# EAGLE design OMAPProc_Rev2 (EAGLE 6.2)
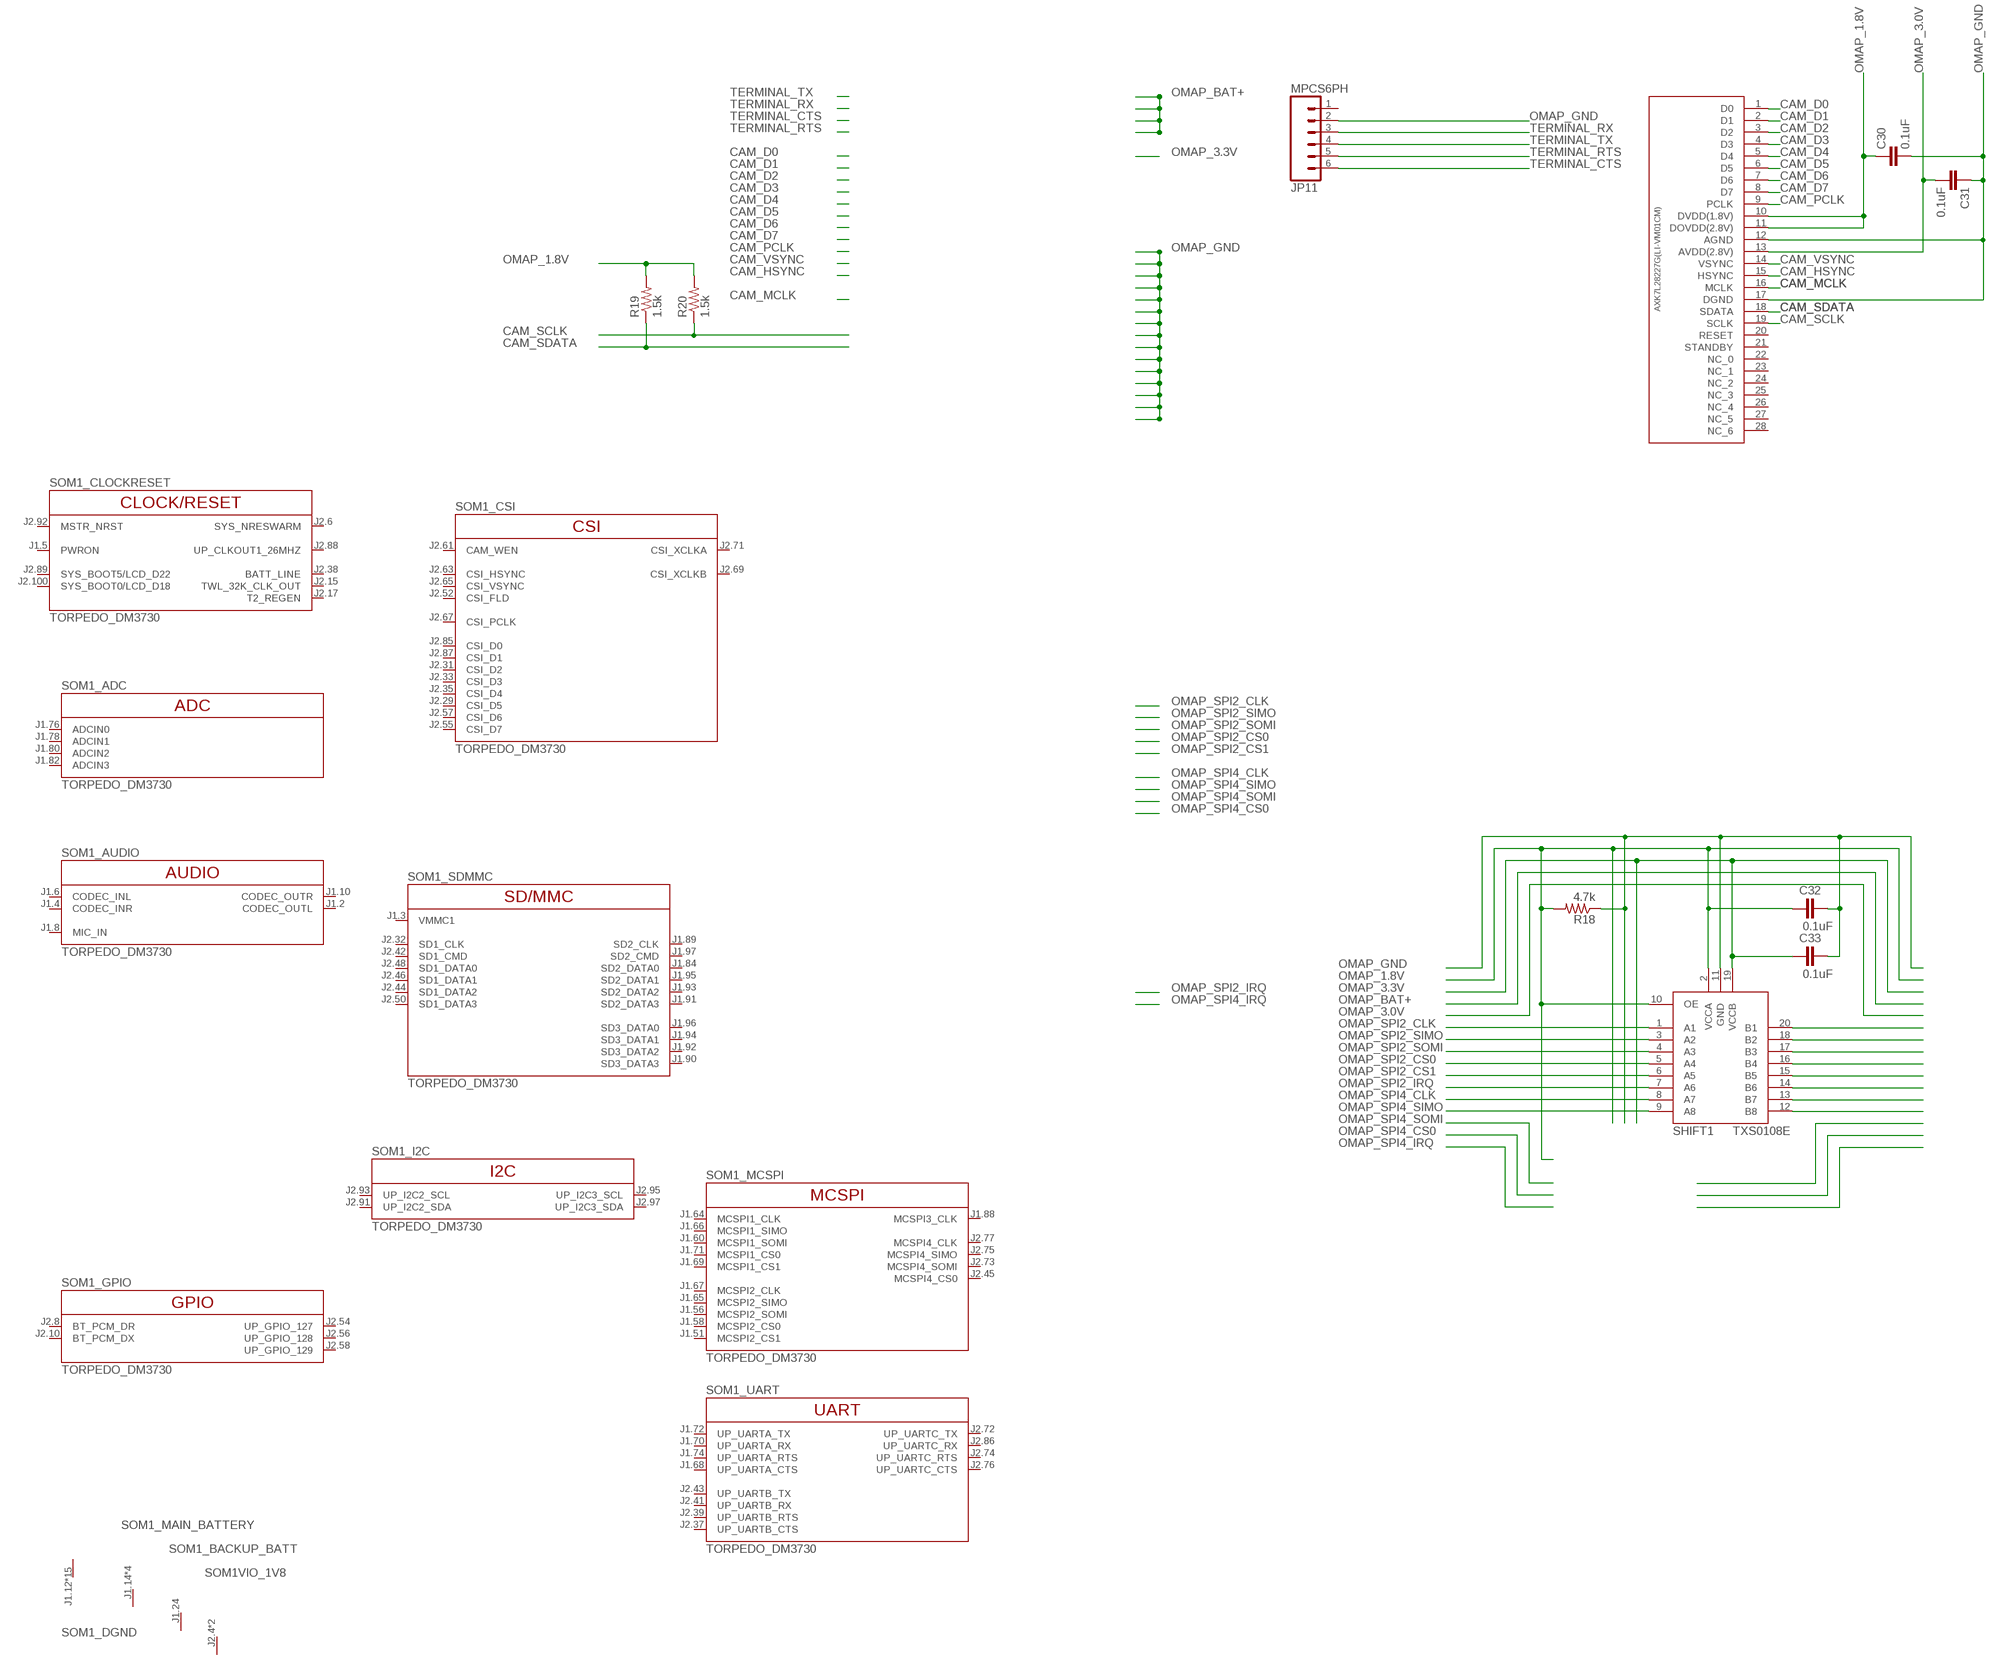
[diagram p0: schematic, sheet 1]

## Parts
C30  0.1uF  CAP0402-CAP  [0402-CAP]
C31  0.1uF  CAP0402-CAP  [0402-CAP]
C32  0.1uF  CAP0402-CAP  [0402-CAP]
C33  0.1uF  CAP0402-CAP  [0402-CAP]
CAM1  AXK7L28227G(LI-VM01CM)  [AXK7L28227G]
JP11  MPCS6PH  [MOLEX-PICO_CLASP_S6P]
R18  4.7k  R-US_R0402  [R0402]
R19  1.5k  R-US_R0402  [R0402]
R20  1.5k  R-US_R0402  [R0402]
SHIFT1  TXS0108E  [PW_R-PDSO-G20]
SOM1  TORPEDO_DM3730  [TORPEDO_DM3730]

## Nets
CAM_D0: CAM1.1(D0)
CAM_D1: CAM1.2(D1)
CAM_D2: CAM1.3(D2)
CAM_D3: CAM1.4(D3)
CAM_D4: CAM1.5(D4)
CAM_D5: CAM1.6(D5)
CAM_D6: CAM1.7(D6)
CAM_D7: CAM1.8(D7)
CAM_HSYNC: CAM1.15(HSYNC)
CAM_MCLK: CAM1.16(MCLK)
CAM_PCLK: CAM1.9(PCLK)
CAM_SCLK: CAM1.19(SCLK) R20.1
CAM_SDATA: CAM1.18(SDATA) R19.1
CAM_VSYNC: CAM1.14(VSYNC)
N$18: SHIFT1.20(B1)
N$22: SHIFT1.18(B2)
N$27: SHIFT1.17(B3)
N$30: SHIFT1.16(B4)
N$31: SHIFT1.15(B5)
N$33: SHIFT1.14(B6)
N$34: SHIFT1.13(B7)
N$35: SHIFT1.12(B8)
OMAP_1.8V: C30.1 C32.1 CAM1.10(DVDD(1.8V)) CAM1.11(DOVDD(2.8V)) R18.2 R19.2 R20.2 SHIFT1.2(VCCA) SHIFT1.10(OE)
OMAP_3.0V: C31.2 CAM1.13(AVDD(2.8V))
OMAP_3.3V: C33.1 SHIFT1.19(VCCB)
OMAP_GND [sup]: C30.2 C31.1 C32.2 C33.2 CAM1.12(AGND) CAM1.17(DGND) JP11.2 R18.1 SHIFT1.11(GND)
OMAP_SPI2_CLK: SHIFT1.1(A1)
OMAP_SPI2_CS0: SHIFT1.5(A4)
OMAP_SPI2_CS1: SHIFT1.6(A5)
OMAP_SPI2_IRQ: SHIFT1.7(A6)
OMAP_SPI2_SIMO: SHIFT1.3(A2)
OMAP_SPI2_SOMI: SHIFT1.4(A3)
OMAP_SPI4_CLK: SHIFT1.8(A7)
OMAP_SPI4_SIMO: SHIFT1.9(A8)
TERMINAL_CTS: JP11.6
TERMINAL_RTS: JP11.5
TERMINAL_RX: JP11.3
TERMINAL_TX: JP11.4
Unconnected: CAM1.20(RESET) CAM1.21(STANDBY) CAM1.22(NC_0) CAM1.23(NC_1) CAM1.24(NC_2) CAM1.25(NC_3) CAM1.26(NC_4) CAM1.27(NC_5) CAM1.28(NC_6) JP11.1 SOM1.J1.1(_GPMC:UP_NWE) SOM1.J1.2(_AUDIO:CODEC_OUTL) SOM1.J1.3(_SDMMC:VMMC1) SOM1.J1.4(_AUDIO:CODEC_INR) SOM1.J1.5(_CLOCKRESET:PWRON) SOM1.J1.6(_AUDIO:CODEC_INL) SOM1.J1.7(_GPMC:UP_A9) SOM1.J1.8(_AUDIO:MIC_IN) SOM1.J1.9(_GPMC:UP_NCS0) SOM1.J1.10(_AUDIO:CODEC_OUTR) SOM1.J1.11(_GPMC:UP_NCS1) SOM1.J1.13(_GPMC:UP_A8) SOM1.J1.15(_GPMC:UP_NOE) SOM1.J1.19(_GPMC:UP_BUS_CLK) SOM1.J1.21(_GPMC:UP_NBE1) SOM1.J1.23(_GPMC:UP_NADV_ALE) SOM1.J1.25(_GPMC:UP_NBE0) SOM1.J1.26(_GPMC:UP_NWAIT) SOM1.J1.28(_GPMC:UP_NCS6) SOM1.J1.29(_GPMC:UP_D8) SOM1.J1.30(_GPMC:UP_DREQ0) SOM1.J1.31(_GPMC:UP_D9) SOM1.J1.32(_GPMC:UP_NCS5) SOM1.J1.33(_GPMC:UP_D2) SOM1.J1.34(_GPMC:UP_NCS4) SOM1.J1.35(_GPMC:UP_D0) SOM1.J1.36(_GPMC:UP_NCS3) SOM1.J1.37(_GPMC:UP_D1) SOM1.J1.38(_GPMC:UP_A10) SOM1.J1.39(_GPMC:UP_D3) SOM1.J1.40(_GPMC:UP_NCS2) SOM1.J1.41(_GPMC:UP_D12) SOM1.J1.42(_GPMC:UP_A4) SOM1.J1.43(_GPMC:UP_D10) SOM1.J1.44(_GPMC:UP_A3) SOM1.J1.45(_GPMC:UP_D11) SOM1.J1.46(_GPMC:UP_A2) SOM1.J1.47(_GPMC:UP_D13) SOM1.J1.48(_GPMC:UP_A1) SOM1.J1.49(_GPMC:UP_D4) SOM1.J1.50(_GPMC:UP_A7) SOM1.J1.51(_MCSPI:MCSPI2_CS1) SOM1.J1.52(_GPMC:UP_A6) SOM1.J1.53(_GPMC:UP_D6) SOM1.J1.54(_GPMC:UP_A5) SOM1.J1.55(_GPMC:UP_D7) SOM1.J1.56(_MCSPI:MCSPI2_SOMI) SOM1.J1.57(_GPMC:UP_D5) SOM1.J1.58(_MCSPI:MCSPI2_CS0) SOM1.J1.59(_GPMC:UP_D14) SOM1.J1.60(_MCSPI:MCSPI1_SOMI) SOM1.J1.62(_MCBSP:MCBSP4_DR) SOM1.J1.63(_GPMC:UP_D15) SOM1.J1.64(_MCSPI:MCSPI1_CLK) SOM1.J1.65(_MCSPI:MCSPI2_SIMO) SOM1.J1.66(_MCSPI:MCSPI1_SIMO) SOM1.J1.67(_MCSPI:MCSPI2_CLK) SOM1.J1.68(_UART:UP_UARTA_CTS) SOM1.J1.69(_MCSPI:MCSPI1_CS1) SOM1.J1.70(_UART:UP_UARTA_RX) SOM1.J1.71(_MCSPI:MCSPI1_CS0) SOM1.J1.72(_UART:UP_UARTA_TX) SOM1.J1.73(_LCDTV:LCD_PANEL_PWR) SOM1.J1.74(_UART:UP_UARTA_RTS) SOM1.J1.75(_LCDTV:LCD_BACKLIGHT_PWR) SOM1.J1.76(_ADC:ADCIN0) SOM1.J1.77(_MCBSP:MCBSP3_DR) SOM1.J1.78(_ADC:ADCIN1) SOM1.J1.79(_MCBSP:MCBSP3_DX) SOM1.J1.80(_ADC:ADCIN2) SOM1.J1.81(_MCBSP:MCBSP3_FSX) SOM1.J1.82(_ADC:ADCIN3) SOM1.J1.83(_MCBSP:MCBSP3_CLKX) SOM1.J1.84(_SDMMC:SD2_DATA0) SOM1.J1.86(_LCDTV:LCD_D17) SOM1.J1.87(_LCDTV:LCD_D23/SYS_BOOT6) SOM1.J1.88(_MCSPI:MCSPI3_CLK) SOM1.J1.89(_SDMMC:SD2_CLK) SOM1.J1.90(_SDMMC:SD3_DATA3) SOM1.J1.91(_SDMMC:SD2_DATA3) SOM1.J1.92(_SDMMC:SD3_DATA2) SOM1.J1.93(_SDMMC:SD2_DATA2) SOM1.J1.94(_SDMMC:SD3_DATA1) SOM1.J1.95(_SDMMC:SD2_DATA1) SOM1.J1.96(_SDMMC:SD3_DATA0) SOM1.J1.97(_SDMMC:SD2_CMD) SOM1.J1.98(_GPMC:UP_IODIR) SOM1.J1.99(_LCDTV:LCD_D16) SOM1.J2.3(_USB:USB1_D+) SOM1.J2.5(_USB:USB1_D-) SOM1.J2.6(_CLOCKRESET:SYS_NRESWARM) SOM1.J2.8(_GPIO:BT_PCM_DR) SOM1.J2.9(_USB:USB1_ID) SOM1.J2.10(_GPIO:BT_PCM_DX) SOM1.J2.11(_USB:USB1_VBUS) SOM1.J2.12(_LCDTV:LCD_HSYNC) SOM1.J2.13(_USB:USB1_VBUS) SOM1.J2.14(_LCDTV:LCD_VSYNC) SOM1.J2.15(_CLOCKRESET:TWL_32K_CLK_OUT) SOM1.J2.16(_LCDTV:LCD_MDISP) SOM1.J2.17(_CLOCKRESET:T2_REGEN) SOM1.J2.18(_LCDTV:LCD_D6/G1) SOM1.J2.20(_LCDTV:LCD_D20/SYS_BOOT3) SOM1.J2.22(_LCDTV:LCD_D9/G4) SOM1.J2.24(_LCDTV:LCD_D8/G3) SOM1.J2.26(_LCDTV:LCD_D7/G2) SOM1.J2.28(_LCDTV:LCD_DCLK) SOM1.J2.29(_CSI:CSI_D5) SOM1.J2.31(_CSI:CSI_D2) SOM1.J2.32(_SDMMC:SD1_CLK) SOM1.J2.33(_CSI:CSI_D3) SOM1.J2.34(_LCDTV:LCD_D19/SYS_BOOT1) SOM1.J2.35(_CSI:CSI_D4) SOM1.J2.36(_LCDTV:LCD_D18/SYS_BOOT0) SOM1.J2.37(_UART:UP_UARTB_CTS) SOM1.J2.38(_CLOCKRESET:BATT_LINE) SOM1.J2.39(_UART:UP_UARTB_RTS) SOM1.J2.40(_LCDTV:LCD_D21/SYS_BOOT4) SOM1.J2.41(_UART:UP_UARTB_RX) SOM1.J2.42(_SDMMC:SD1_CMD) SOM1.J2.43(_UART:UP_UARTB_TX) SOM1.J2.44(_SDMMC:SD1_DATA2) SOM1.J2.45(_MCSPI:MCSPI4_CS0) SOM1.J2.46(_SDMMC:SD1_DATA1) SOM1.J2.47(_MCBSP:MCBSP2_DX) SOM1.J2.48(_SDMMC:SD1_DATA0) SOM1.J2.49(_MCBSP:MCBSP2_CLKX) SOM1.J2.50(_SDMMC:SD1_DATA3) SOM1.J2.51(_MCBSP:MCBSP2_FSX) SOM1.J2.52(_CSI:CSI_FLD) SOM1.J2.53(_MCBSP:MCBSP2_DR) SOM1.J2.54(_GPIO:UP_GPIO_127) SOM1.J2.55(_CSI:CSI_D7) SOM1.J2.56(_GPIO:UP_GPIO_128) SOM1.J2.57(_CSI:CSI_D6) SOM1.J2.58(_GPIO:UP_GPIO_129) SOM1.J2.60(_LCDTV:TV_OUT2) SOM1.J2.61(_CSI:CAM_WEN) SOM1.J2.63(_CSI:CSI_HSYNC) SOM1.J2.64(_LCDTV:TV_OUT1) SOM1.J2.65(_CSI:CSI_VSYNC) SOM1.J2.66(_LCDTV:LCD_D14/R4) SOM1.J2.67(_CSI:CSI_PCLK) SOM1.J2.68(_LCDTV:LCD_D13/R3) SOM1.J2.69(_CSI:CSI_XCLKB) SOM1.J2.70(_LCDTV:LCD_D12/R2) SOM1.J2.71(_CSI:CSI_XCLKA) SOM1.J2.72(_UART:UP_UARTC_TX) SOM1.J2.73(_MCSPI:MCSPI4_SOMI) SOM1.J2.74(_UART:UP_UARTC_RTS) SOM1.J2.75(_MCSPI:MCSPI4_SIMO) SOM1.J2.76(_UART:UP_UARTC_CTS) SOM1.J2.77(_MCSPI:MCSPI4_CLK) SOM1.J2.78(_LCDTV:LCD_D15/R5) SOM1.J2.79(_LCDTV:LCD_D2/B3) SOM1.J2.80(_LCDTV:LCD_D22/SYS_BOOT5) SOM1.J2.81(_LCDTV:LCD_D3/B4) SOM1.J2.82(_LCDTV:LCD_D10/G5) SOM1.J2.83(_LCDTV:LCD_D1/B2) SOM1.J2.84(_LCDTV:LCD_D11/R1) SOM1.J2.85(_CSI:CSI_D0) SOM1.J2.86(_UART:UP_UARTC_RX) SOM1.J2.87(_CSI:CSI_D1) SOM1.J2.88(_CLOCKRESET:UP_CLKOUT1_26MHZ) SOM1.J2.89(_CLOCKRESET:SYS_BOOT5/LCD_D22) SOM1.J2.91(_I2C:UP_I2C2_SDA) SOM1.J2.92(_CLOCKRESET:MSTR_NRST) SOM1.J2.93(_I2C:UP_I2C2_SCL) SOM1.J2.94(_LCDTV:LCD_D4/B5) SOM1.J2.95(_I2C:UP_I2C3_SCL) SOM1.J2.96(_LCDTV:LCD_D5/G0) SOM1.J2.97(_I2C:UP_I2C3_SDA) SOM1.J2.98(_LCDTV:LCD_D0/B1) SOM1.J2.100(_CLOCKRESET:SYS_BOOT0/LCD_D18)

## Power pins joined to a net without a drawn wire
V+: SOM1.J1.14(_MAIN_BATTERY:V+) SOM1.J1.16(_MAIN_BATTERY:V+) SOM1.J1.18(_MAIN_BATTERY:V+) SOM1.J1.20(_MAIN_BATTERY:V+) SOM1.J1.24(_BACKUP_BATT:V+) SOM1.J2.4(VIO_1V8:V+) SOM1.J2.7(VIO_1V8:V+)
V-: SOM1.J1.12(_DGND:V-) SOM1.J1.17(_DGND:V-) SOM1.J1.22(_DGND:V-) SOM1.J1.27(_DGND:V-) SOM1.J1.61(_DGND:V-) SOM1.J1.85(_DGND:V-) SOM1.J1.100(_DGND:V-) SOM1.J2.1(_DGND:V-) SOM1.J2.2(_DGND:V-) SOM1.J2.27(_DGND:V-) SOM1.J2.30(_DGND:V-) SOM1.J2.59(_DGND:V-) SOM1.J2.62(_DGND:V-) SOM1.J2.90(_DGND:V-) SOM1.J2.99(_DGND:V-)

## Library data of the parts
C30-C33 = SparkFun:CAP: Capacitor Standard 0603 ceramic capacitor, and 0.1" leaded capacitor.
CAM1 = user:AXK7L28227G(LI-VM01CM)
JP11 = stan:MPCS6P: Molex Pico-Clasp Single Row 6 Pos
R18-R20 = rcl:R-US_: RESISTOR, American symbol
SHIFT1 = user:TXS0108E
SOM1 = biomimetic:TORPEDO_DM3730

## Net classes
1 sup: width 0.254 mm

## Board
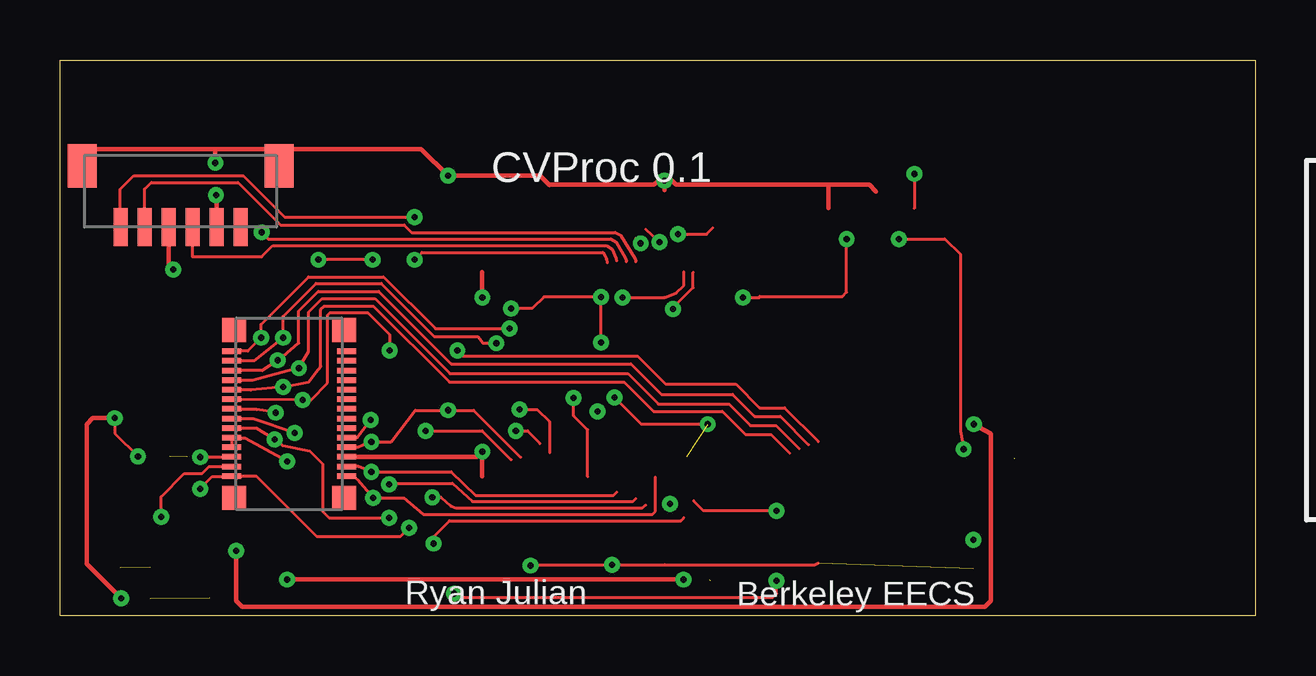
[diagram p1: board, top side]
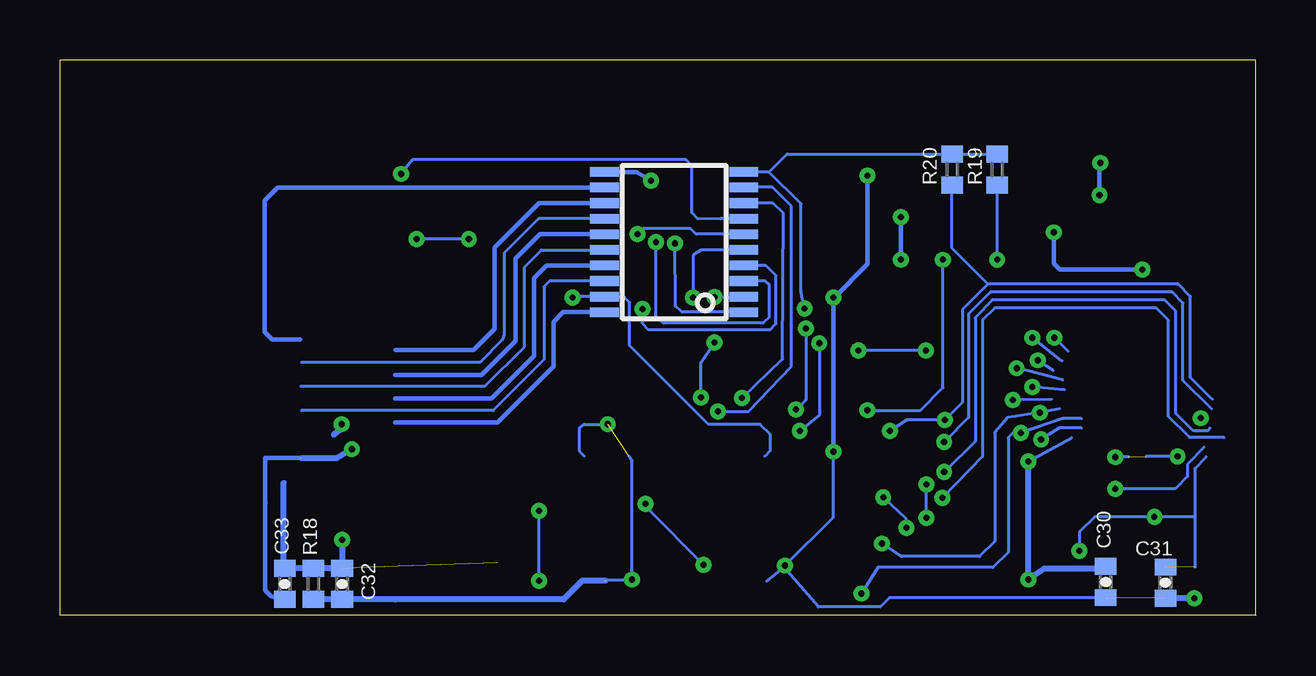
[diagram p2: board, bottom side, seen from below]

Size 49.83 x 23.17 mm. Coordinates in mm from the lower left corner, seen from the top.
Outline: 0,0.01 0,0
Outline: 0,0.01 0,23.18 49.84,23.18 49.84,0.01 0,0.01
Copper layers (1*16): Top 0.0356mm / dielectric 1.5011mm / Bottom 0.0356mm
Design rules: minimum track width 5mil, minimum drill 6mil, track to track 5mil, track to pad 5mil, pad to pad 5mil, via to via 5mil, smd to smd 5mil, copper to edge 15mil, drill to drill 8mil, minimum pad ring 10mil, minimum via ring 8mil, stop-mask expansion 4mil, vias tented up to drill 0mil, thermal gap 10mil

### Footprints (pad centres in the part's own frame; a part is rotated, then mirrored left to right if it is on the bottom)
0402-CAP = smd 0.7 x 0.9: 1 -0.65,0; 2 0.65,0
AXK7L28227G = smd 0.23 x 0.8: 1 0.6,2.4; 2 0.2,2.4; 3 -0.2,2.4; 4 -0.6,2.4; 5 -1,2.4; 6 -1.4,2.4; 7 -1.8,2.4; 8 -2.2,2.4; 9 -2.6,2.4; 10 -3,2.4; 11 -3.4,2.4; 12 -3.8,2.4; 13 -4.2,2.4; 14 -4.6,2.4; 15 -4.6,-2.4; 16 -4.2,-2.4; 17 -3.8,-2.4; 18 -3.4,-2.4; 19 -3,-2.4; 20 -2.6,-2.4; 21 -2.2,-2.4; 22 -1.8,-2.4; 23 -1.4,-2.4; 24 -1,-2.4; 25 -0.6,-2.4; 26 -0.2,-2.4; 27 0.2,-2.4; 28 0.6,-2.4 | smd 1 x 1: M1 1.5,2.3; M14 -5.5,2.3; M15 -5.5,-2.3; M28 1.5,-2.3
MOLEX-PICO_CLASP_S6P = smd 0.6 x 1.6: 1 -2.5,1; 2 -1.5,1; 3 -0.5,1; 4 0.5,1; 5 1.5,1; 6 2.5,1 | smd 1.2 x 1.8: A -4.1,-1.55; B 4.1,-1.55
R0402 = smd 0.7 x 0.9: 1 -0.65,0; 2 0.65,0
PW_R-PDSO-G20 = smd 0.4 x 1.2: 1 -2.925,-2.9; 2 -2.275,-2.9; 3 -1.625,-2.9; 4 -0.975,-2.9; 5 -0.325,-2.9; 6 0.325,-2.9; 7 0.975,-2.9; 8 1.625,-2.9; 9 2.275,-2.9; 10 2.925,-2.9; 11 2.925,2.9; 12 2.275,2.9; 13 1.625,2.9; 14 0.975,2.9; 15 0.325,2.9; 16 -0.325,2.9; 17 -0.975,2.9; 18 -1.625,2.9; 19 -2.275,2.9; 20 -2.925,2.9
TORPEDO_DM3730 = smd 0.2 x 1.44: J1.1 -9.8,-7.06; J1.2 -9.8,-4.12; J1.3 -9.4,-7.06; J1.4 -9.4,-4.12; J1.5 -9,-7.06; J1.6 -9,-4.12; J1.7 -8.6,-7.06; J1.8 -8.6,-4.12; J1.9 -8.2,-7.06; J1.10 -8.2,-4.12; J1.11 -7.8,-7.06; J1.12 -7.8,-4.12; J1.13 -7.4,-7.06; J1.14 -7.4,-4.12; J1.15 -7,-7.06; J1.16 -7,-4.12; J1.17 -6.6,-7.06; J1.18 -6.6,-4.12; J1.19 -6.2,-7.06; J1.20 -6.2,-4.12; J1.21 -5.8,-7.06; J1.22 -5.8,-4.12; J1.23 -5.4,-7.06; J1.24 -5.4,-4.12; J1.25 -5,-7.06; J1.26 -5,-4.12; J1.27 -4.6,-7.06; J1.28 -4.6,-4.12; J1.29 -4.2,-7.06; J1.30 -4.2,-4.12; J1.31 -3.8,-7.06; J1.32 -3.8,-4.12; J1.33 -3.4,-7.06; J1.34 -3.4,-4.12; J1.35 -3,-7.06; J1.36 -3,-4.12; J1.37 -2.6,-7.06; J1.38 -2.6,-4.12; J1.39 -2.2,-7.06; J1.40 -2.2,-4.12; J1.41 -1.8,-7.06; J1.42 -1.8,-4.12; J1.43 -1.4,-7.06; J1.44 -1.4,-4.12; J1.45 -1,-7.06; J1.46 -1,-4.12; J1.47 -0.6,-7.06; J1.48 -0.6,-4.12; J1.49 -0.2,-7.06; J1.50 -0.2,-4.12; J1.51 0.2,-7.06; J1.52 0.2,-4.12; J1.53 0.6,-7.06; J1.54 0.6,-4.12; J1.55 1,-7.06; J1.56 1,-4.12; J1.57 1.4,-7.06; J1.58 1.4,-4.12; J1.59 1.8,-7.06; J1.60 1.8,-4.12; J1.61 2.2,-7.06; J1.62 2.2,-4.12; J1.63 2.6,-7.06; J1.64 2.6,-4.12; J1.65 3,-7.06; J1.66 3,-4.12; J1.67 3.4,-7.06; J1.68 3.4,-4.12; J1.69 3.8,-7.06; J1.70 3.8,-4.12; J1.71 4.2,-7.06; J1.72 4.2,-4.12; J1.73 4.6,-7.06; J1.74 4.6,-4.12; J1.75 5,-7.06; J1.76 5,-4.12; J1.77 5.4,-7.06; J1.78 5.4,-4.12; J1.79 5.8,-7.06; J1.80 5.8,-4.12; J1.81 6.2,-7.06; J1.82 6.2,-4.12; J1.83 6.6,-7.06; J1.84 6.6,-4.12; J1.85 7,-7.06; J1.86 7,-4.12; J1.87 7.4,-7.06; J1.88 7.4,-4.12; J1.89 7.8,-7.06; J1.90 7.8,-4.12; J1.91 8.2,-7.06; J1.92 8.2,-4.12; J1.93 8.6,-7.06; J1.94 8.6,-4.12; J1.95 9,-7.06; J1.96 9,-4.12; J1.97 9.4,-7.06; J1.98 9.4,-4.12; J1.99 9.8,-7.06; J1.100 9.8,-4.12; J2.1 -9.8,4.12; J2.2 -9.8,7.06; J2.3 -9.4,4.12; J2.4 -9.4,7.06; J2.5 -9,4.12; J2.6 -9,7.06; J2.7 -8.6,4.12; J2.8 -8.6,7.06; J2.9 -8.2,4.12; J2.10 -8.2,7.06; J2.11 -7.8,4.12; J2.12 -7.8,7.06; J2.13 -7.4,4.12; J2.14 -7.4,7.06; J2.15 -7,4.12; J2.16 -7,7.06; J2.17 -6.6,4.12; J2.18 -6.6,7.06; J2.19 -6.2,4.12; J2.20 -6.2,7.06; J2.21 -5.8,4.12; J2.22 -5.8,7.06; J2.23 -5.4,4.12; J2.24 -5.4,7.06; J2.25 -5,4.12; J2.26 -5,7.06; J2.27 -4.6,4.12; J2.28 -4.6,7.06; J2.29 -4.2,4.12; J2.30 -4.2,7.06; J2.31 -3.8,4.12; J2.32 -3.8,7.06; J2.33 -3.4,4.12; J2.34 -3.4,7.06; J2.35 -3,4.12; J2.36 -3,7.06; J2.37 -2.6,4.12; J2.38 -2.6,7.06; J2.39 -2.2,4.12; J2.40 -2.2,7.06; J2.41 -1.8,4.12; J2.42 -1.8,7.06; J2.43 -1.4,4.12; J2.44 -1.4,7.06; J2.45 -1,4.12; J2.46 -1,7.06; J2.47 -0.6,4.12; J2.48 -0.6,7.06; J2.49 -0.2,4.12; J2.50 -0.2,7.06; J2.51 0.2,4.12; J2.52 0.2,7.06; J2.53 0.6,4.12; J2.54 0.6,7.06; J2.55 1,4.12; J2.56 1,7.06; J2.57 1.4,4.12; J2.58 1.4,7.06; J2.59 1.8,4.12; J2.60 1.8,7.06; J2.61 2.2,4.12; J2.62 2.2,7.06; J2.63 2.6,4.12; J2.64 2.6,7.06; J2.65 3,4.12; J2.66 3,7.06; J2.67 3.4,4.12; J2.68 3.4,7.06; J2.69 3.8,4.12; J2.70 3.8,7.06; J2.71 4.2,4.12; J2.72 4.2,7.06; J2.73 4.6,4.12; J2.74 4.6,7.06; J2.75 5,4.12; J2.76 5,7.06; J2.77 5.4,4.12; J2.78 5.4,7.06; J2.79 5.8,4.12; J2.80 5.8,7.06; J2.81 6.2,4.12; J2.82 6.2,7.06; J2.83 6.6,4.12; J2.84 6.6,7.06; J2.85 7,4.12; J2.86 7,7.06; J2.87 7.4,4.12; J2.88 7.4,7.06; J2.89 7.8,4.12; J2.90 7.8,7.06; J2.91 8.2,4.12; J2.92 8.2,7.06; J2.93 8.6,4.12; J2.94 8.6,7.06; J2.95 9,4.12; J2.96 9,7.06; J2.97 9.4,4.12; J2.98 9.4,7.06; J2.99 9.8,4.12; J2.100 9.8,7.06

### Placement (x,y rotation side)
C30  6.25,1.41 270 bottom
C31  3.76,1.38 90 bottom
C32  38.07,1.33 90 bottom
C33  40.46,1.33 90 bottom
CAM1  9.55,10.42 90 top
JP11  5.03,17.21 180 top
R18  39.27,1.33 270 bottom
R19  10.77,18.6 90 bottom
R20  12.65,18.6 90 bottom
SHIFT1  24.23,15.58 90 bottom
SOM1  65.66,11.49 180 top  (outside the outline)

### Tracks (layer width: path | path; a pad name or v marks a point on that pad's centre or on a via)
CAM_D0  (via drill 0.25 pad 0.66)
  Top 0.127: v8.38,11.59 7.82,11.03 7.26,11.03 CAM1.1 | v8.38,11.59 8.38,11.64 | v18.75,11.97 15.65,11.97 13.49,14.13 10.36,14.13 8.38,12.15 v8.38,11.59 | v19.15,8.6 19.89,8.6 20.4,8.1 20.41,6.81
  Bottom 0.127: 7.81,11.02 v8.38,11.59 | v18.75,11.97 18.75,9 v19.15,8.6
CAM_D1  (via drill 0.25 pad 0.66)
  Top 0.127: CAM1.2 7.25,10.63 8.08,10.63 v9.3,11.59 9.3,12.48 10.67,13.85 13.39,13.85 15.6,11.64 17.42,11.64 17.63,11.36 v18.19,11.36 | v19,7.71 19.5,7.71 20.01,7.19 20.01,7.18
  Bottom 0.127: 8.07,10.62 v9.3,11.59 | v18.19,11.36 18.19,8.37 v19,7.71
CAM_D2  (via drill 0.25 pad 0.66)
  Top 0.127: 7.25,10.22 CAM1.3 8.43,10.22 v9.07,10.65 9.14,10.65 9.3,10.8 9.96,11.36 9.96,12.71 10.77,13.52 13.28,13.52 16.31,10.5 23.8,10.5 25.07,9.23 28.04,9.23 28.96,8.32 30.02,8.32 31.21,7.13
  Bottom 0.127: 8.44,10.22 v9.07,10.65
CAM_D3  (via drill 0.25 pad 0.66)
  Top 0.127: CAM1.4 7.26,9.81 8.03,9.81 v9.96,10.32 10.36,11.01 10.36,12.66 10.92,13.22 13.13,13.22 16.26,10.09 23.67,10.09 24.94,8.82 27.89,8.82 28.78,7.93 29.84,7.93 30.81,6.97
  Bottom 0.127: 8.04,9.82 v9.96,10.32
CAM_D4  (via drill 0.25 pad 0.66)
  Top 0.127: CAM1.5 7.27,9.41 7.95,9.41 v9.3,9.54 10.36,9.74 10.67,10.15 10.87,10.4 10.87,12.76 11.02,12.91 13.06,12.91 16.23,9.74 23.52,9.74 24.74,8.52 27.61,8.52 28.57,7.55 29.64,7.55 30.41,6.79
  Top 0.178: CAM1.5 7.24,9.43
  Bottom 0.127: 7.97,9.42 v9.3,9.54
CAM_D5  (via drill 0.25 pad 0.66)
  Top 0.127: CAM1.6 7.25,9.03 v10.11,9 10.46,9 11.15,9.71 11.15,12.53 11.25,12.63 12.83,12.63 13.74,11.72 v13.74,11.06 | 31.61,7.26 30.2,8.67 29.16,8.67 28.17,9.66 25.25,9.66 24.08,10.83 16.79,10.83 v16.56,11.06
  Bottom 0.127: 8.51,9.02 v10.11,9 | v13.74,11.06 v16.56,11.06
CAM_D6  (via drill 0.25 pad 0.66)
  Top 0.127: v8.99,8.47 8.2,8.6 7.28,8.6 CAM1.7 | 26.01,4.09 25.88,3.96 16.23,3.96 15.57,3.3 v15.57,3.01
  Bottom 0.127: 8.18,8.62 v8.99,8.47 10.01,8.32 10.33,8.27 10.87,7.64 10.87,3.11 11.51,2.47 14.76,2.47 15.57,3.03 v15.57,3.01
CAM_D7  (via drill 0.25 pad 0.66)
  Top 0.127: v9.78,7.63 8.05,8.21 7.26,8.21 CAM1.8 | 26.41,4.79 26.82,4.38 v29.87,4.38 | v29.87,1.46 29.87,0.92 29.72,0.77 16.59,0.77 v16.43,0.92
  Bottom 0.127: 7.25,8.22 | 7.25,8.22 8.04,8.22 v9.78,7.63 10.11,7.63 10.31,7.43 10.31,2.65 10.95,2.02 15.75,2.02 v16.43,0.92 | v29.87,1.46 v29.87,4.38
CAM_HSYNC  (via drill 0.25 pad 0.66)
  Top 0.127: CAM1.15 12.3,5.77 12.4,5.67 v13.06,4.91 14.33,4.91 15.14,4.23 24.69,4.23 24.82,4.35 24.82,5.79
  Bottom 0.127: 1.31,7.43 2.74,7.43 3.63,8.32 3.63,12.33 4.14,12.84 10.87,12.84 11.38,12.33 11.38,6.64 v13.06,4.91
CAM_MCLK  (via drill 0.25 pad 0.66)
  Top 0.127: CAM1.16 12.43,6.22 v12.98,6 | v12.98,6 12.98,6.03 v12.98,6 | v12.98,6 16.31,6 17.32,5.03 23.08,5.03 23.21,5.15
  Bottom 0.127: 1.89,7.82 1.98,7.71 2.59,7.71 3.33,8.44 3.33,12.71 3.79,13.17 10.97,13.17 11.68,12.43 11.68,7.27 v12.98,6 12.98,6.03
CAM_PCLK  (via drill 0.25 pad 0.66)
  Top 0.127: CAM1.9 7.27,7.81 8.2,7.81 v8.94,7.35 9.02,7.35 9.27,7.1 10.41,6.87 10.95,6.33 10.95,4.35 11.23,4.07 v13.72,4.07 | v13.72,5.47 13.72,5.52 16.36,5.52 17.2,4.76 23.88,4.76 24.01,4.89
  Bottom 0.127: 7.25,7.82 | 7.25,7.82 8.19,7.82 v8.94,7.35 | v13.72,4.07 v13.72,5.47
CAM_SCLK  (via drill 0.25 pad 0.66)
  Top 0.127: CAM1.19 12.39,7.42 v12.95,8.16 | 18.81,6.5 17.6,7.71 v15.24,7.71
  Bottom 0.127: 1.8,9.02 2.72,9.94 2.72,13.32 3.23,13.83 11.15,13.83 | 11.15,13.83 12.22,12.76 12.22,8.9 v12.95,8.16 14.53,8.16 v15.24,7.71 | R20.1 12.65,15.33 11.15,13.83
CAM_SDATA  (via drill 0.25 pad 0.66)
  Top 0.127: CAM1.18 12.42,7.02 12.98,7.27 v12.98,7.25 13.79,7.25 14.81,8.57 v16.18,8.57 17.25,8.57 19.21,6.61 | v13.03,14.84 v10.77,14.84
  Bottom 0.127: 1.83,8.62 3.02,9.81 3.02,13.04 3.48,13.5 11.05,13.5 11.96,12.58 11.96,8.27 v12.98,7.25 | v10.77,14.84 R19.1 | v13.03,14.84 13.03,9.51 13.97,8.57 v16.18,8.57
CAM_VSYNC  (via drill 0.25, 0.25 pad 0.66)
  Top 0.127: v5.84,5.29 6.35,5.8 7.13,5.8 CAM1.14 8.18,5.82 10.69,3.31 14.2,3.31 v14.55,3.67 | v15.52,4.94 15.88,4.94 16.28,4.58 16.51,4.49 24.28,4.49 24.41,4.62
  Bottom 0.127: 2.16,7.02 2.85,6.31 2.85,5.8 3.35,5.29 v5.84,5.29 | v14.55,3.67 14.55,4.05 v15.52,4.94
N$18
  Bottom 0.178: SHIFT1.20 28.86,12.65 29.26,12.25 29.26,10.4 31.6,8.06 35.87,8.06
N$22
  Bottom 0.127: SHIFT1.18 29.44,13.96 29.67,13.73 29.67,10.68 31.77,8.56 39.77,8.56
N$27
  Bottom 0.178: SHIFT1.17 29.55,14.61 30.07,14.08 30.07,10.83 31.85,9.05 35.87,9.05
N$30
  Bottom 0.127: SHIFT1.16 29.76,15.25 30.48,14.54 30.48,11.21 32.13,9.56 39.78,9.56
N$31
  Bottom 0.178: SHIFT1.15 29.82,15.9 30.84,14.89 30.84,11.46 32.26,10.04 35.86,10.04
N$33
  Bottom 0.127: SHIFT1.14 29.89,16.56 31.32,15.12 31.32,11.72 31.39,11.54 31.41,11.5 32.33,10.56 39.77,10.56
N$34
  Bottom 0.178: SHIFT1.13 29.87,17.21 31.73,15.35 31.73,11.95 32.59,11.08 35.85,11.08
N$35
  Bottom 0.178: SHIFT1.12 40.75,17.86 41.3,17.31 41.3,11.82 41,11.52 39.83,11.52
OMAP_1.8V  (via drill 0.25, 0.25 pad 0.66)  (2 unrouted)
  Top 0.127: v18.8,12.81 19.68,12.81 20.17,13.29 v22.55,13.29 v22.55,11.39 | v27,7.99 24.23,7.99 v23.11,9.1 | v9.47,6.44 7.72,7.4 7.28,7.4 CAM1.10 CAM1.11
  Top 0.178: v9.47,1.51 v25.98,1.51
  Bottom 0.127: v9.47,6.44 7.67,7.42 | 35.87,0.68 35.87,0.69 | 26.13,6.65 25.98,6.46 v25.98,1.51 26.01,1.48 27.08,1.48 | 20.27,18.51 SHIFT1.10 | 20.27,18.51 18.95,17.18 18.95,13.52 v18.8,12.81 | v22.55,13.29 21.34,13.29 SHIFT1.2 | 27.98,6.65 28.17,6.84 28.17,7.83 27.99,7.99 v27,7.99 | v23.11,9.1 23.11,10.55 v22.55,11.39 | R19.2 R20.2 19.53,19.25 20.27,18.51
  Bottom 0.178: C30.1 6.34,1.97
  Bottom 0.254: R18.2 C32.1 35.87,0.68 28.84,0.68 28.07,1.46 27.11,1.46 | v9.47,6.44 v9.47,1.51 8.81,1.97 6.34,1.97
OMAP_3.0V  (via drill 0.25)  (1 unrouted)
  Top 0.127: CAM1.13 6.21,6.22 5.92,5.93 5.18,5.93 4.22,4.96 v4.22,4.13 v4.21,4.12
  Top 0.178: v38.1,7.99 38.79,7.6 38.81,7.58 38.81,0.62 38.56,0.37 7.59,0.37 7.34,0.62 v7.34,2.7
  Bottom 0.127: 2.06,6.62 2.51,6.14 2.52,5.95 2.52,4.12 | 2.52,2.03 2.52,4.12 | v7.34,2.7 7.34,3.49 6.71,4.12 4.87,4.12 v4.21,4.12 3.99,4.12 2.52,4.12
  Bottom 0.254: 3.74,2.02 C31.2 | v38.1,7.99 38.17,7.75 38.41,7.56
OMAP_3.3V  (via drill 0.25, 0.25 pad 0.66)  (1 unrouted)
  Top 0.127: v28.47,13.27 29.16,13.27 29.16,13.32 32.61,13.32 32.79,13.5 v32.79,15.71 | v34.98,15.71 36.88,15.71 37.54,15.07 37.54,7.71 v37.67,6.94
  Bottom 0.127: 41.27,4.76 41.22,4.71 | SHIFT1.19 27.12,13.32 | SHIFT1.19 28.43,13.3 v28.47,13.27 | 20.46,6.65 20.24,6.87 20.24,7.58 20.65,7.99 22.81,7.99 26.09,11.26 26.09,13.07 26.31,13.29 27.12,13.29 SHIFT1.19 | v32.79,15.71 v34.98,15.71
  Bottom 0.178: C33.1 41.02,0.81 41.27,1.06 41.27,4.76 41.27,6.59 39.81,6.59
  Bottom 0.254: v37.67,6.94 38.3,6.56 39.78,6.56
OMAP_GND  (via drill 0.25, 0.25 pad 0.66)  (3 unrouted)
  Top 0.127: 19.61,2.17 v19.61,2.09 19.63,2.12 v23.01,2.12 25.22,2.12 | v5.84,6.61 CAM1.12 | v2.29,8.24 2.29,7.6 v3.25,6.64 | 31.61,2.2 31.45,2.12 25.22,2.12 | 25.22,2.12 25.21,2.13 | v25.43,4.66 25.61,4.84
  Top 0.178: 38.1,3.16 v38.08,3.16 | 20.41,17.95 20.41,17.97 20.42,17.97 | v25.2,18.15 25.21,17.76 | 20.42,17.97 24.77,17.97 24.94,18.15 v25.2,18.15 | 34.01,17.69 33.73,17.97 32,17.97 | v25.2,18.15 25.5,18.15 25.68,17.97 32,17.97 | 32.03,17 32.03,17.94 32,17.97 | v17.6,13.27 17.6,14.33 | 17.6,5.8 v17.6,6.84 17.38,6.62 CAM1.17 | 20.41,17.95 20.42,17.97 | 6.53,19.47 0.94,19.47 0.71,19.24 0.71,18.02 | JP11.2 6.53,17.54 v6.5,17.54 | v6.48,18.88 6.48,19.42 6.53,19.47 | v2.55,0.73 1.12,2.16 1.12,7.99 1.37,8.24 v2.29,8.24 | 20.41,17.95 20.01,18.35 v16.18,18.35 15.06,19.47 6.53,19.47
  Bottom 0.127: 6.48,0.73 C30.2 15.26,0.76 15.65,0.37 18.23,0.37 19.68,2.03 | 5.3,6.62 v5.84,6.61 | v2.29,8.24 2.27,8.22 | v3.25,6.64 4.57,6.64 | v23.01,2.12 25.32,4.46 25.32,4.56 v25.43,4.66 | 20.37,1.45 19.81,1.91 19.68,2.03 | 19.68,2.03 v19.61,2.09 17.6,4.1 v17.6,6.84
  Bottom 0.178: 40.51,5.52 40.48,5.56 | C33.2 40.51,2.16 | SHIFT1.11 25.81,18.51 v25.2,18.15 | v17.6,6.84 17.6,13.22 | 17.6,13.22 v17.6,13.27 | v6.5,17.54 6.5,18.83 v6.48,18.88 | 17.6,13.22 16.18,14.67 v16.18,18.35
  Bottom 0.254: C33.2 R18.1 C32.2 v38.08,3.16 | 40.51,2.16 40.51,5.52 | v2.55,0.73 C31.1
OMAP_SPI2_CLK  (via drill 0.25 pad 0.66)
  Top 0.127: v24.21,15.53 24.01,15.73
  Bottom 0.127: v24.21,15.53 24.18,12.91 23.9,12.66 SHIFT1.1
OMAP_SPI2_CS0  (via drill 0.25)
  Top 0.127: v23.44,13.27 25.2,13.27 25.68,13.45 26.01,13.78 26.01,14.33
  Bottom 0.127: SHIFT1.5 23.11,15.25 23.44,15.03 23.44,14.92 v23.44,13.27
OMAP_SPI2_CS1  (via drill 0.25 pad 0.66)
  Top 0.127: 27.21,16.17 26.95,15.91 v25.76,15.91
  Bottom 0.127: SHIFT1.6 23.32,15.91 23.55,16.14 25.53,16.14 v25.76,15.91
OMAP_SPI2_IRQ  (via drill 0.25 pad 0.66)
  Top 0.127: v35.61,18.43 35.61,16.98
  Bottom 0.127: SHIFT1.7 22.31,16.56 23.24,16.55 23.5,16.8 23.5,18.76 23.75,19.01 35.13,19.01 v35.61,18.43
OMAP_SPI2_SIMO  (via drill 0.25)
  Top 0.127: v24.99,15.58 24.41,16.12
  Bottom 0.127: v24.99,15.58 24.99,12.46 24.66,12.2 20.52,12.2 20.27,12.46 20.27,13.8 20.42,13.96 SHIFT1.3
OMAP_SPI2_SOMI  (via drill 0.25)
  Top 0.127: v25.55,12.79 25.6,12.89 26.39,13.67 26.39,14.32
  Bottom 0.127: SHIFT1.4 20.41,14.61 19.99,14.18 19.99,12.18 20.24,11.92 25.3,11.92 25.55,12.18 v25.55,12.79
OMAP_SPI4_CLK  (via drill 0.25)
  Top 0.127: 22,5.81 22,7.76 21.41,8.34 v21.41,9.08
  Bottom 0.127: SHIFT1.8 20.12,17.21 19.68,16.8 19.71,10.8 19.71,10.7 v21.41,9.08
OMAP_SPI4_SIMO  (via drill 0.25)
  Top 0.127: 22.41,8.24 v22.4,8.52
  Bottom 0.127: v22.4,8.52 21.13,8.52 19.36,10.4 19.36,17.08 20.14,17.87 SHIFT1.9
TERMINAL_CTS  (via drill 0.25)
  Top 0.127: 22.81,14.72 22.77,14.87 22.71,15.01 22.63,15.15 15.09,15.15 v14.78,14.84 | v14.78,16.62 9.37,16.62 7.64,18.35 3.07,18.35 2.52,17.79 2.52,16.22 JP11.6
  Bottom 0.178: v14.78,16.62 v14.78,14.84
TERMINAL_RTS
  Top 0.127: 24.01,14.77 23.97,14.9 23.37,15.87 23.15,15.99 14.66,15.99 14.35,16.29 9.2,16.29 7.42,18.07 3.81,18.07 3.53,17.79 JP11.5
TERMINAL_RX
  Top 0.127: 23.21,14.8 23.18,14.9 23,15.28 22.77,15.43 8.87,15.43 8.41,14.97 5.53,14.97 JP11.3
TERMINAL_TX  (via drill 0.25)
  Top 0.127: 23.61,14.77 23.57,14.89 23.19,15.58 22.97,15.71 8.69,15.71 v8.41,15.99
  Top 0.178: 4.7,14.46 v4.72,14.44 4.53,14.63 JP11.4
  Bottom 0.178: v8.41,15.99 8.41,14.69 8.15,14.44 v4.72,14.44
V+  (6 unrouted)
V-  (14 unrouted)

### Text on the board
tPlace: CVProc 0.1 | Ryan Julian | Berkeley EECS